# Altium schematic sheet MCU-main-board-schematic.SchDoc: MCU-main-board Swiss Solar Boat
size A4; Date: 04.03.2022; SheetNumber: 1; SheetTotal: 2
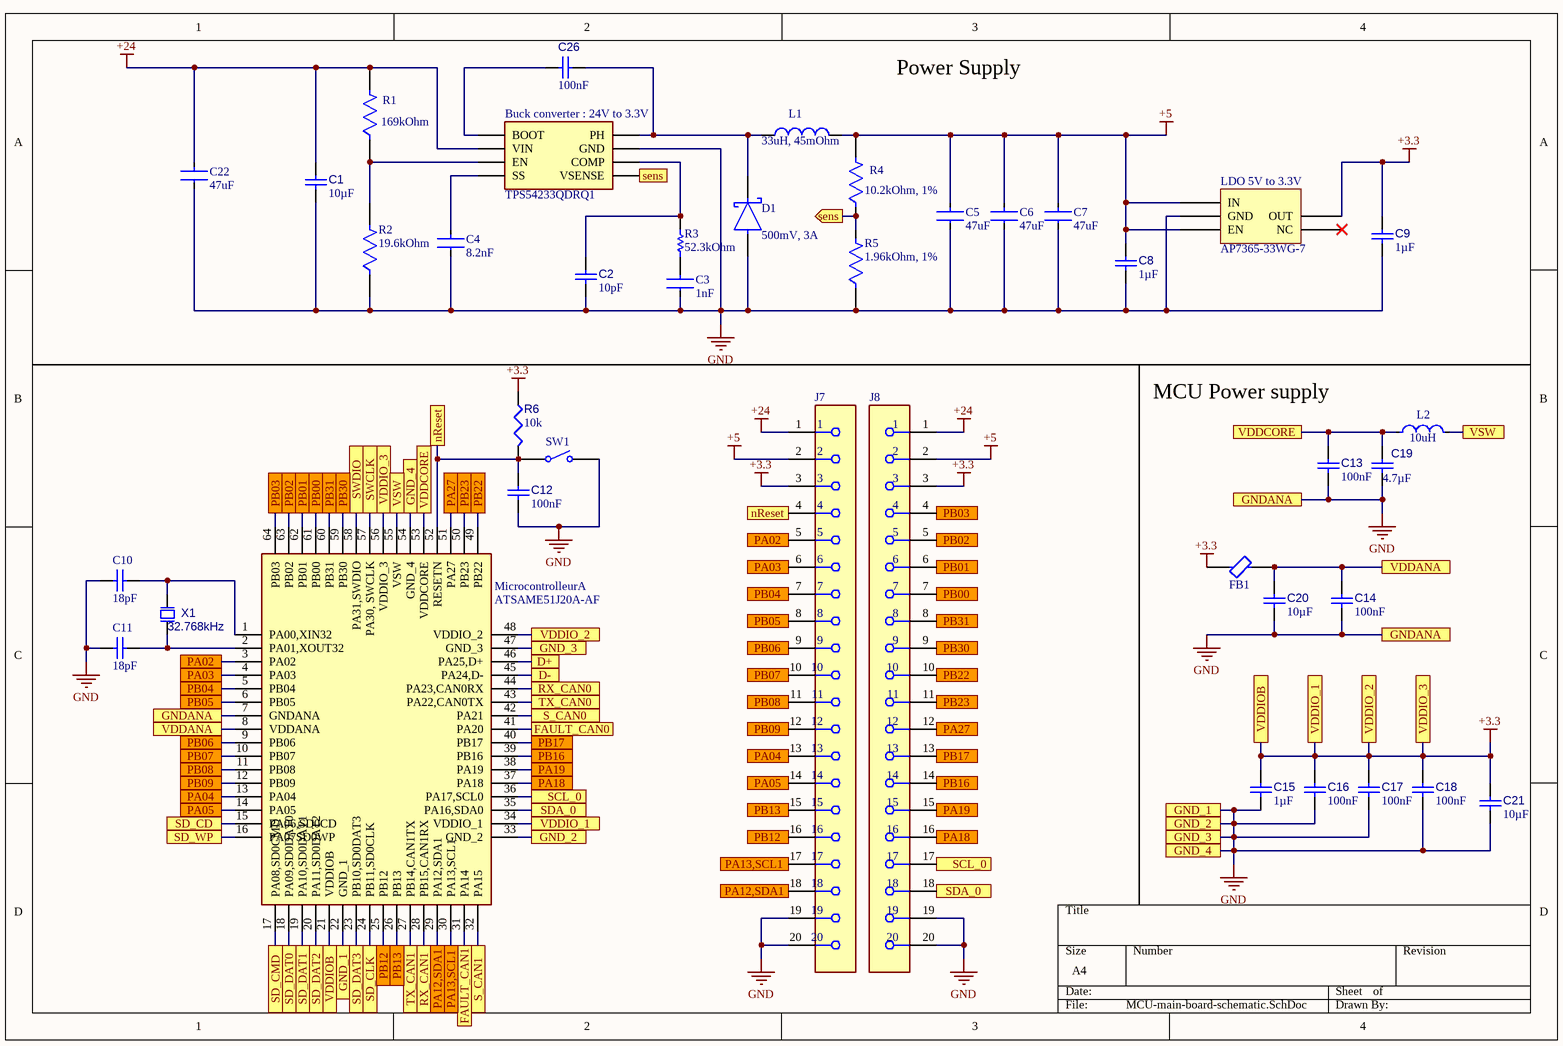
[diagram p0: MCU-main-board-schematic.SchDoc]

## Parts
Buck_converter_:_24V_to_3.3V  TPS54233QDRQ1  [SOIC127P600X175-8N]
C1  value 10µF  [CAPC0805(2012)145_L]  (hidden comment: Capacitor 10µF +/-20% 25V 0805)
C2  value 10pF  [CAPC1608X90X40ML10T20]  (hidden comment: Capacitor 10 pF +/- 5% 50 V 0603)
C3  1nF  [FP-0603-L_1_6_0_15-W_0_81-IPC_A]
C4  8.2nF  [FP-CL10-IPC_B]
C5  47uF  [FP-GRM32E-0_3-0_2-IPC_C]
C6  47uF  [FP-GRM32E-0_3-0_2-IPC_C]
C7  47uF  [FP-GRM32E-0_3-0_2-IPC_C]
C8  value 1µF  [CAPC0603(1608)100_L]  (hidden comment: Capacitor 1µF +/-40% 50V 0603)
C9  value 1µF  [CAPC0603(1608)100_L]  (hidden comment: Capacitor 1µF +/-40% 50V 0603)
C10  18pF  [CAPC1608X90X40LL10T20]
C11  18pF  [CAPC1608X90X40LL10T20]
C12  value 100nF  [CAPC1608X90X40ML10T20]  (hidden comment: Capacitor 100 nF +/-10% 50 V 0603)
C13  value 100nF  [CAPC1608X90X40ML10T20]  (hidden comment: Capacitor 100 nF +/-10% 50 V 0603)
C14  value 100nF  [CAPC1608X90X40ML10T20]  (hidden comment: Capacitor 100 nF +/-10% 50 V 0603)
C15  value 1µF  [CAPC0603(1608)100_L]  (hidden comment: Capacitor 1µF +/-40% 50V 0603)
C16  value 100nF  [CAPC1608X90X40ML10T20]  (hidden comment: Capacitor 100 nF +/-10% 50 V 0603)
C17  value 100nF  [CAPC1608X90X40ML10T20]  (hidden comment: Capacitor 100 nF +/-10% 50 V 0603)
C18  value 100nF  [CAPC1608X90X40ML10T20]  (hidden comment: Capacitor 100 nF +/-10% 50 V 0603)
C19  value 4.7µF  [CAPC0805(2012)145_L]  (hidden comment: Capacitor 4.7µF +/-40% 25V 0805)
C20  value 10µF  [CAPC0805(2012)145_L]  (hidden comment: Capacitor 10µF +/-20% 25V 0805)
C21  value 10µF  [CAPC0805(2012)145_L]  (hidden comment: Capacitor 10µF +/-20% 25V 0805)
C22  47uF  [FP-GRM32E-0_3-0_2-IPC_C]
C26  value 100nF  [CAPC1608X90X40ML10T20]  (hidden comment: Capacitor 100 nF +/-10% 50 V 0603)
D1  500mV, 3A  [FP-95402-MFG]
FB1  BLM18SG221TN1D  [FP-BLM18-0_15-t0_5-IPC_A]  (value not drawn)
J7  ESQ-120-14-G-S  [FP-ESQ-120-14-G-S-MFG]  (value not drawn)
J8  ESQ-120-14-G-S  [FP-ESQ-120-14-G-S-MFG]  (value not drawn)
L1  33uH, 45mOhm  [WE-PD-XXL]
L2  10uH  [FP-CB3225-IPC_A]
LDO_5V_to_3.3V  AP7365-33WG-7  [SOT95P245X110-5N]
Microcontrolleur  ATSAME51J20A-AF  [QFP50P1200X1200X120-64N]  (part A of 6)
R1  169kOhm  [FP-CRCW0603-e3-IPC_C]
R2  19.6kOhm  [FP-RR0816-IPC_C]
R3  52.3kOhm  [RESC1608X55X30LL15T15]
R4  10.2kOhm, 1%  [FP-CRCW0603-e3-MFG]
R5  1.96kOhm, 1%  [FP-RR0816-IPC_C]
R6  value 10k  [RESC1608X55X25ML10T15]  (hidden comment: Resistor 10k +/-1% 0603 100 mW)
SW1  FSMSM  [TECO-FSMSM-2_V]  (value not drawn)
X1  32.768kHz  [EPSON-FC-135_V]

## Ports
D+, D-, FAULT_CAN0, FAULT_CAN1, GND_1, GND_2, GND_3, GND_4, GNDANA, nReset, PA02, PA03, PA04, PA05, PA12,SDA1, PA13,SCL1, PA18, PA19, PA27, PB00, PB01, PB02, PB03, PB04, PB05, PB06, PB07, PB08, PB09, PB12, PB13, PB16, PB17, PB22, PB23, PB30, PB31, RX_CAN0, RX_CAN1, S_CAN0, S_CAN1, SCL_0, SD_CD, SD_CLK, SD_CMD, SD_DAT0, SD_DAT1, SD_DAT2, SD_DAT3, SD_WP, SDA_0, sens (in), sens (out), SWCLK, SWDIO, TX_CAN0, TX_CAN1, VDDANA, VDDCORE, VDDIO_1, VDDIO_2, VDDIO_3, VDDIOB, VSW

## Nets
+3.3: C9.2 C15.2 C16.2 C17.2 C18.2 C21.2 FB1.1 J7.3 J8.3 LDO_5V_to_3.3V.5(OUT) Microcontrolleur.21(VDDIOB) Microcontrolleur.34(VDDIO_1) Microcontrolleur.48(VDDIO_2) Microcontrolleur.56(VDDIO_3) R6.1 ; port VDDIO_1, port VDDIO_2, port VDDIO_3, port VDDIOB
+5: C5.1 C6.1 C7.1 C8.2 J7.2 J8.2 L1.2 LDO_5V_to_3.3V.1(IN) LDO_5V_to_3.3V.3(EN) R4.2
+24: Buck_converter_:_24V_to_3.3V.2(VIN) C1.2 C22.1 J7.1 J8.1 R1.2
GND: Buck_converter_:_24V_to_3.3V.7(GND) C1.1 C2.1 C3.2 C4.2 C5.2 C6.2 C7.2 C8.1 C9.1 C10.1 C11.1 C12.1 C13.1 C14.1 C15.1 C16.1 C17.1 C18.1 C19.1 C20.1 C21.1 C22.2 D1.2(A) J7.19 J7.20 J8.19 J8.20 LDO_5V_to_3.3V.2(GND) Microcontrolleur.7(GNDANA) Microcontrolleur.22(GND_1) Microcontrolleur.33(GND_2) Microcontrolleur.47(GND_3) Microcontrolleur.54(GND_4) R2.1 R5.1 SW1.2 ; port GND_1, port GND_2, port GND_3, port GND_4, port GNDANA
D+: Microcontrolleur.46(PA25,D+) ; port D+
D-: Microcontrolleur.45(PA24,D-) ; port D-
FAULT_CAN0: Microcontrolleur.41(PA20) ; port FAULT_CAN0
FAULT_CAN1: Microcontrolleur.31(PA14) ; port FAULT_CAN1
nReset: C12.2 J7.4 Microcontrolleur.52(RESETN) R6.2 SW1.1 ; port nReset
PA02: J7.5 Microcontrolleur.3(PA02) ; port PA02
PA03: J7.6 Microcontrolleur.4(PA03) ; port PA03
PA04: J7.13 Microcontrolleur.13(PA04) ; port PA04
PA05: J7.14 Microcontrolleur.14(PA05) ; port PA05
PA12,SDA1: J7.18 Microcontrolleur.29(PA12,SDA1) ; port PA12,SDA1
PA13,SCL1: J7.17 Microcontrolleur.30(PA13,SCL1) ; port PA13,SCL1
PA18: J8.16 Microcontrolleur.37(PA18) ; port PA18
PA19: J8.15 Microcontrolleur.38(PA19) ; port PA19
PA27: J8.12 Microcontrolleur.51(PA27) ; port PA27
PB00: J8.7 Microcontrolleur.61(PB00) ; port PB00
PB01: J8.6 Microcontrolleur.62(PB01) ; port PB01
PB02: J8.5 Microcontrolleur.63(PB02) ; port PB02
PB03: J8.4 Microcontrolleur.64(PB03) ; port PB03
PB04: J7.7 Microcontrolleur.5(PB04) ; port PB04
PB05: J7.8 Microcontrolleur.6(PB05) ; port PB05
PB06: J7.9 Microcontrolleur.9(PB06) ; port PB06
PB07: J7.10 Microcontrolleur.10(PB07) ; port PB07
PB08: J7.11 Microcontrolleur.11(PB08) ; port PB08
PB09: J7.12 Microcontrolleur.12(PB09) ; port PB09
PB12: J7.16 Microcontrolleur.25(PB12) ; port PB12
PB13: J7.15 Microcontrolleur.26(PB13) ; port PB13
PB16: J8.14 Microcontrolleur.39(PB16) ; port PB16
PB17: J8.13 Microcontrolleur.40(PB17) ; port PB17
PB22: J8.10 Microcontrolleur.49(PB22) ; port PB22
PB23: J8.11 Microcontrolleur.50(PB23) ; port PB23
PB30: J8.9 Microcontrolleur.59(PB30) ; port PB30
PB31: J8.8 Microcontrolleur.60(PB31) ; port PB31
RX_CAN0: Microcontrolleur.44(PA23,CAN0RX) ; port RX_CAN0
RX_CAN1: Microcontrolleur.28(PB15,CAN1RX) ; port RX_CAN1
S_CAN0: Microcontrolleur.42(PA21) ; port S_CAN0
S_CAN1: Microcontrolleur.32(PA15) ; port S_CAN1
SCL_0: J8.17 Microcontrolleur.36(PA17,SCL0) ; port SCL_0
SD_CD: Microcontrolleur.15(PA06,SD0CD) ; port SD_CD
SD_CLK: Microcontrolleur.24(PB11,SD0CLK) ; port SD_CLK
SD_CMD: Microcontrolleur.17(PA08,SD0CMD) ; port SD_CMD
SD_DAT0: Microcontrolleur.18(PA09,SD0DAT0) ; port SD_DAT0
SD_DAT1: Microcontrolleur.19(PA10,SD0DAT1) ; port SD_DAT1
SD_DAT2: Microcontrolleur.20(PA11,SD0DAT2) ; port SD_DAT2
SD_DAT3: Microcontrolleur.23(PB10,SD0DAT3) ; port SD_DAT3
SD_WP: Microcontrolleur.16(PA07SD0WP) ; port SD_WP
SDA_0: J8.18 Microcontrolleur.35(PA16,SDA0) ; port SDA_0
sens: Buck_converter_:_24V_to_3.3V.5(VSENSE) R4.1 R5.2 ; port sens
SWCLK: Microcontrolleur.57(PA30,_SWCLK) ; port SWCLK
SWDIO: Microcontrolleur.58(PA31,SWDIO) ; port SWDIO
TX_CAN0: Microcontrolleur.43(PA22,CAN0TX) ; port TX_CAN0
TX_CAN1: Microcontrolleur.27(PB14,CAN1TX) ; port TX_CAN1
VDDANA: C14.2 C20.2 FB1.2 Microcontrolleur.8(VDDANA) ; port VDDANA
VDDCORE: C13.2 C19.2 L2.1 Microcontrolleur.53(VDDCORE) ; port VDDCORE
VSW: L2.2 Microcontrolleur.55(VSW) ; port VSW
NetBuck_converter_:_24V_to_3.3V_1: Buck_converter_:_24V_to_3.3V.1(BOOT) C26.2
NetBuck_converter_:_24V_to_3.3V_3: Buck_converter_:_24V_to_3.3V.3(EN) R1.1 R2.2
NetBuck_converter_:_24V_to_3.3V_4: Buck_converter_:_24V_to_3.3V.4(SS) C4.1
NetBuck_converter_:_24V_to_3.3V_6: Buck_converter_:_24V_to_3.3V.6(COMP) C2.2 R3.2
NetBuck_converter_:_24V_to_3.3V_8: Buck_converter_:_24V_to_3.3V.8(PH) C26.1 D1.1(C) L1.1
NetC3_1: C3.1 R3.1
NetC10_2: C10.2 Microcontrolleur.1(PA00,XIN32) X1.1
NetC11_2: C11.2 Microcontrolleur.2(PA01,XOUT32) X1.2

Not connected (* = marked no-connect by the designer): LDO_5V_to_3.3V 4(NC)*

## Notes on the sheet
- Power Supply
- MCU Power supply

## Library data of the parts
Buck_converter_:_24V_to_3.3V = TPS54233QDRQ1: Integrated Circuit; Manufacturer_Name: Texas Instruments; Datasheet Link: http://www.ti.com/lit/gpn/tps54233-q1; Height: 1.75mm; Manufacturer_Part_Number: TPS54233QDRQ1; Mouser Part Number: 595-TPS54233QDRQ1; Mouser Price/Stock: https://www.mouser.co.uk/ProductDetail/Texas-Instruments/TPS54233QDRQ1?qs=5771e39Rz9EgVp4sSedJGA%3D%3D; Arrow Part Number: TPS54233QDRQ1; Arrow Price/Stock: https://www.arrow.com/en/products/tps54233qdrq1/texas-instruments
C1 C20 C21 = CMP-001-00079-2: Chip Capacitor, 10µF +/-20%, 25V, 0805, Thickness 1.45 mm; Tolerance: 10%; Pins: 2; Max Operating Temperature: 85°C; Mounting Technology: SMT; Case/Package: 0603; Voltage Rating: 25V; Min Operating Temperature: -55°C
C2 = CMP-001-00014-4: Chip Capacitor, 10 pF, +/- 5%, 50 V, 0603 (1608 Metric); Voltage Rating: 50V; Capacitor Type: Ceramic; RoHS Compliant: True; Max Operating Temperature: 125°C; Pins: 2; Tolerance: 5%; Case/Package: 0603; Mounting Technology: SM; Min Operating Temperature: -55°C
C3 = CMP-2006-04378-2: General Purpose Ceramic Capacitor, 0603, 1nF, 10%, X7R, 15%, 50V; Case Code (Metric): 1608; Min Operating Temperature: -55°C; Weight: 7.1E-05oz; Series: -; Capacitance: 1nF; RoHS Compliant: Yes; Radiation Hardening: No; Height: 0.9mm; Mount: Surface Mount; REACH SVHC: No SVHC; Lead Free: Lead Free; Depth: 0.81mm; Voltage: 50V; Number of Pins: 2; Voltage Rating: 50V; Max Operating Temperature: 125°C; Termination: SMD/SMT; Construction: Flat; Case Code (Imperial): 0603; Dielectric: X7R; Width: 0.032inch; Tolerance: 10%; Case/Package: 0603; Contact Plating: Tin; Packaging: Tape and Reel; Voltage Rating (DC): 50V; Dielectric Material: Ceramic; Package Quantity: 4000; Thickness: 0.035inch; Length: 1.6mm
C4 = CMP-2000-06097-2: Cap Ceramic 8.2nF 50V X7R ±10% Pad SMD 0603 +125°C T/R; Voltage Rating: 50V; Dielectric: X7R; Length: 1.6mm; Mount: Surface Mount; Lead Free: Lead Free; Width: 0.031inch; Series: CL; Case Code (Imperial): 0603; Capacitance: 8.2nF; Case/Package: 0603; RoHS Compliant: Yes; Package Quantity: 1; Material: Ceramic; Voltage: 50V; Voltage Rating (DC): 50V; Thickness: 0.035inch; Max Operating Temperature: 125°C; Height: 0.8mm; Min Operating Temperature: -55°C; Tolerance: 10%; Depth: 0.8mm; Radiation Hardening: No; Case Code (Metric): 1608; Packaging: Tape and Reel; Construction: Flat
C5-C7 C22 = CMP-2000-06362-2: CAP CER 47UF 16V X5R 1210; Tolerance: 10%; Material: Ceramic; Case Code (Metric): 3225; RoHS Compliant: Yes; Min Operating Temperature: -55°C; Radiation Hardening: No; Voltage: 16V; Package Quantity: 1; Case Code (Imperial): 1210; REACH SVHC: No SVHC; Capacitance: 47uF; Voltage Rating (DC): 16V; Dielectric: X5R; Case/Package: 1210; Length: 3.2mm; Voltage Rating: 16V; Packaging: Cut Tape; Width: 0.098inch; Number of Pins: 2; Lead Free: Lead Free; Height: 2.5mm; Mount: Surface Mount; Termination: SMD/SMT; Max Operating Temperature: 85°C; Thickness: 0.106inch; Depth: 2.5mm
C8 C9 C15 = CMP-001-00078-2: Chip Capacitor, 1µF +/-40%, 50V, 0603, Thickness 1 mm; Tolerance: 10%; Max Operating Temperature: 85°C; Voltage Rating: 50V; Pins: 2; Case/Package: 0402; Mounting Technology: SMT; Min Operating Temperature: -55°C
C10 C11 = CMP-1659-00030-1: Chip Capacitor, 18 pF, +/- 5%, 50 V, -55 to 125 degC, 0603 (1608 Metric), RoHS, Tape and Reel; Voltage Rating: 50 V; Case\Package: 0603; Power Rating: 100 mW; Resistance: 68.1 Ohm; Tolerance: 1%; Case Code (Metric): 1608; Max Operating Temperature: 155 degC; RoHSCompliant: true; Case Code (Imperial): 0603; ComponentLink2Description: Datasheet; Package Quantity: 200; PackageReference: 0603; ComponentLink2URL: http://www.yageo.com/NewPortal/yageodocoutput?fileName=/pdf/MLCC/UPY-GP_NP0_16V-to-50V_14.pdf; Length: 1.6 mm; DatasheetVersion: Rev. 14, 07/2016; Min Operating Temperature: -55 degC; ComponentLink1URL: http://www.yageo.com/; Width: 0.8 mm; ComponentLink1Description: Manufacturer URL; Height: 0.45 mm; Radiation Hardening: No; PackageDescription: 2-Pin Surface Mount Device, Body 1.6 x 0.8 mm; Packaging: Tape and Reel
C12-C14 C16-C18 C26 = CMP-001-00017-4: Chip Capacitor, 100 nF, +/- 10%, 50 V, 0603 (1608 Metric); Capacitor Type: Ceramic; Voltage Rating: 50V; RoHS Compliant: True; Max Operating Temperature: 125°C; Pins: 2; Mounting Technology: SM; Min Operating Temperature: -55°C; Tolerance: 10%; Case/Package: 0603
C19 = CMP-001-00080-2: Chip Capacitor, 4.7µF +/-40%, 25V, 0805, Thickness 1.45 mm; Tolerance: 20%; Voltage Rating: 25V; Min Operating Temperature: -55°C; Case/Package: 0402; Pins: 2; Mounting Technology: SMT; Max Operating Temperature: 85°C
D1 = CMP-02539-000012-1: DIODE SCHOTTKY 40V 3A DO214AB; Manufacturer: Vishay; Manufacturer Part Number: SS34-E3/57T; Max Junction Temp: +150°C; Peak Reverse Current: 0.5mA; Max Surge Forward Current: 100A; Standoff Height: 0mm; ComponentLink2Description: Datasheet; Device Class L3: Schottky Diodes; Height: 2.62mm; Max Repetitive Reverse Voltage: 40V; Lead Free: Yes; Package: 95402; Temperature Range High: +150°C; ComponentLink2URL: http://www.vishay.com/docs/88751/ss32.pdf; Temperature: -55°C to +150°C; Footprint Url: http://www.vishay.com/docs/95402/smc.pdf; Automotive: No; Forward Current: 3A; Category: Diode; RoHS: TRUE; Device Class L2: Diodes; Mouser Description: Schottky Diodes & Rectifiers 3.0 Amp 40 Volt; Octopart: https://octopart.com/ss34-e3%2F57t-vishay-39552907; Temperature Range Low: -55°C; Device Class L1: Discrete Semiconductors; Digikey Description: DIODE SCHOTTKY 40V 3A DO214AB
FB1 = CMP-0686-00596-3: Chip Ferrite Bead, 0603, 220Ω @ 100MHz, 25%, 0.04Ω, 2.5A, BLM18SG221TN1D; Impedance: 220R; DC Resistance-Max: 40mR; Number of Circuits: 1; Test Frequency: 100MHz; Material: Ferrite; Lead Free: Lead Free; Width: 0.8mm; Max Current Rating: 2.5A; Termination: SMD/SMT; Depth: 0.95mm; Packaging: Tape and Reel; Case Code (Metric): 1608; DC Current: 2.5A; Weight: 7.1E-05oz; Min Operating Temperature: -55°C; DC Resistance (DCR): 40mR; Max Operating Temperature: 125°C; Core Material: Ferrite; Max DC Current: 2.5A; Case/Package: 0603; REACH SVHC: No SVHC; Height: 0.8mm; Number of Pins: 2; Tolerance: 25%; RoHS Compliant: Yes; Radiation Hardening: No; Current Rating: 2.5A; Number of Lines: 1; Series: BLM18S; Case Code (Imperial): 0603; Length: 1.6mm; Package Quantity: 1
J7 J8 = CMP-02766-000124-1: CONN SOCKET 20POS 0.1 GOLD PCB; Connector Type: Receptacle; Number of Contacts: 20; Contact Resistance: 10mR; Max Voltage Rating (AC): 550V; Max Current Rating: 6.9A; Pitch: 2.54mm; Termination: Solder; Number of Rows: 1; Contact Material: Bronze; Min Operating Temperature: -55°C; Gender: Receptacle; Length: 51.31mm; Orientation: Straight; Max Operating Temperature: 125°C; Radiation Hardening: No; Housing Color: Black; Contact Plating: Gold; REACH SVHC: No SVHC; Packaging: Rail/Tube; Depth: 2.41mm; Housing Material: Polyester; Number of Positions: 20; Mount: Through Hole; Color: Black
L1 = CMP-0227-00179-1: SMD-Shielded Power Inductor WE-PD, L = 33.0 µH; Inductance: 33.0 ÂµH; ComponentLink2Description: Datasheet; PackageVersion: 2004; DatasheetVersion: ver 1, Oct-2004; PackageDescription: SMD Inductor, 2-Leads, Body 12.0 x 12.0 mm; ComponentLink1URL: http://www.we-online.com; ComponentLink2URL: http://www.we-online.de/katalog/media/pdf/7447709330.pdf; PackageReference: WE-PD-XXL; ComponentLink1Description: Manufacturer Link
L2 = CMP-14484-000123-1: SMD Inductors 10uH ±20% 0.9A 0.1729Ω 1210; Shielding: Unshielded; DC Resistance (DCR): 172.9mR; Core Material: Ferrite; Self Resonant Frequency: 23MHz; Max DC Current: 900mA; Test Frequency: 100kHz; Package Quantity: 1000; Military Standard: Not; Inductance: 10uH; Height: 2.5mm; Case Code (Metric): 3225; Width: 0.098inch; Case Code (Imperial): 1210; Inductance Tolerance: 20%; Lead Free: Lead Free; Length: 3.4mm; Max Operating Temperature: 105°C; Resistor Type: Wirewound; Height - Seated (Max): 0.106inch; Series: CB; Packaging: Tape and Reel; Depth: 2.7mm; Number of Pins: 2; Radiation Hardening: No; Tolerance: 20%; Case/Package: 1210; Mount: Surface Mount; Saturation Current: 900mA; Min Operating Temperature: -40°C; DC Current: 900mA; Current Rating: 900mA; Halogen Free: Halogen Free; Termination: SMD/SMT
LDO_5V_to_3.3V = CMP-019-00049-1: IC REG LDO 3.3V 0.6A SOT-25
Microcontrolleur = CMP-002-000002-1: Integrated Circuit; Manufacturer_Name: Microchip; Source: SamacSys.SchLib; Design Item ID: ATSAME51J20A-AF; Manufacturer_Part_Number: ATSAME51J20A-AF; Mouser Price/Stock: https://www.mouser.co.uk/ProductDetail/Microchip-Technology-Atmel/ATSAME51J20A-AF?qs=y6ZabgHbY%252ByKmI%252BFD2VVtQ%3D%3D; Datasheet Link: http://www.microchip.com/mymicrochip/filehandler.aspx?ddocname=en599585; Mouser Part Number: 556-ATSAME51J20A-AF; Height: 1.2mm
R1 = CMP-1012-00760-2: RES Thick Film, 169kΩ, 1%, 0.1W, 100ppm/°C, 0603; Resistance: 169kR; Voltage Rating: 75V; Max Power Dissipation: 100mW; Case Code (Metric): 1608; Radiation Hardening: No; Weight: 7.1E-05oz; Number of Terminations: 2; Contact Plating: Tin; Package Quantity: 10; Military Standard: Not; Composition: Thick Film; Features: Automotive AEC-Q200; Packaging: Tape and Reel; Depth: 0.85mm; Lead Free: Lead Free; Max Operating Temperature: 155°C; Height: 0.45mm; Length: 1.55mm; Temperature Coefficient: 100ppm/°C; Tolerance: 1%; Power Rating: 100mW; Termination: SMD/SMT; Width: 0.033inch; Case/Package: 0603; Min Operating Temperature: -55°C; Case Code (Imperial): 0603; Working Voltage: 75V; Number of Pins: 2; Voltage Rating (DC): 75V
R2 = CMP-2000-02522-2: 19.6kΩ ±0.5% 0.0625W 1/16W Chip Resistor 0603 (1608 Metric) Thin Film; Max Power Dissipation: 63mW; Resistance: 19.6kR; Voltage Rating: 75V; Temperature Coefficient: 25ppm/°C; Power Rating: 62.5mW; Termination: SMD/SMT; Size Code: 0603; Length: 0.063inch; Series: RR; Package Quantity: 1; Height: 0.02inch; RoHS Compliant: Yes; Number of Terminations: 2; Lead Free: Lead Free; Packaging: Tape and Reel; Min Operating Temperature: -55°C; Tolerance: 0.5%; Case Code (Metric): 1608; Voltage Rating (DC): 75V; Case/Package: 0603; Width: 0.031inch; Resistor Type: Thin Film; Case Code (Imperial): 0603; Max Operating Temperature: 125°C
R3 = CMP-2000-00551-1: Part Number: ERJ-3EKF5232V; Manufacturer: Panasonic
R4 = CMP-2000-03840-2: RES Thick Film, 10.2kΩ, 1%, 0.1W, 100ppm/°C, 0603; Voltage Rating: 75V; Power Rating: 100mW; Resistance: 10.2kR; Packaging: Tape and Reel; Features: Automotive AEC-Q200; Case Code (Metric): 1608; Case/Package: 0603; Termination: SMD/SMT; Composition: Thick Film; Height: 0.45mm; Width: 0.033inch; Package Quantity: 10; Number of Terminations: 2; Max Operating Temperature: 155°C; Radiation Hardening: No; Case Code (Imperial): 0603; Tolerance: 1%; Weight: 7.1E-05oz; Lead Free: Lead Free; Voltage Rating (DC): 75V; Contact Plating: Tin; Depth: 0.85mm; Min Operating Temperature: -55°C; Temperature Coefficient: 100ppm/°C; Length: 1.55mm; Max Power Dissipation: 100mW; Military Standard: Not
R5 = CMP-2000-02521-2: 1.96kΩ ±0.5% 0.0625W 1/16W Chip Resistor 0603 (1608 Metric) Thin Film; Power Rating: 62.5mW; Temperature Coefficient: 25ppm/°C; Voltage Rating: 75V; Resistance: 1.96kR; Max Power Dissipation: 63mW; Width: 0.031inch; RoHS Compliant: Yes; Case/Package: 0603; Case Code (Metric): 1608; Length: 0.063inch; Termination: SMD/SMT; Series: RR; Max Operating Temperature: 125°C; Height: 0.02inch; Tolerance: 0.5%; Resistor Type: Thin Film; Min Operating Temperature: -55°C; Case Code (Imperial): 0603; Packaging: Tape and Reel; Package Quantity: 5000; Number of Terminations: 2; Voltage Rating (DC): 75V; Size Code: 0603; Lead Free: Lead Free
R6 = CMP-009-00017-4: Chip Resistor, 10 KOhm, +/- 1%, 01 W, -55 to 155 degC, 0603 (1608 Metric); Voltage Rating: 50V; Power: 100mW; Min Operating Temperature: -55°C; Tolerance: 1%; Case/Package: 0603; Pins: 2; Max Operating Temperature: 155°C; RoHS Compliant: True; Mounting Technology: SM
SW1 = CMP-2000-07511-1: FSMSM Push Button Switch, 50 mA, -35 to 85 degC, 2-Pin SMD, RoHS, Bulk; Manufacturer: TE Connectivity; Actuator Length: 1.07mm; Electrical Life: 20000Cycles; Actuator Material: Polyamide; Current Rating: 50mA; Illumination Type: Illuminated; Voltage Rating (DC): 24V; Contact Resistance: 100mOhm; Case\/Package: SMD/SMT; Operating Force: 180gf; Switch Travel: 0.25mm; Max Voltage Rating (DC): 12V; Throw Configuration: SPST; Packaging: LoosePiece; Max Operating Temperature: 85degC; ELV: Compliant; Package Description: 2-Pin Surface Mount Device, Body 6 x 3.5 mm, Pitch 9.19 mm; RoHSCompliant: true; Manufacturer URL: http://www.te.com/; Contact Plating: Silver; Contact Material: Brass; Mounting Technology: SurfaceMount; Contact Current Rating: 50mA; Datasheet Version: Rev. C2, 08/2014; Datasheet URL: http://www.te.com/commerce/DocumentDelivery/DDEController?Action=showdoc&DocId=Customer+Drawing%7F1437566-3%7FC2%7Fpdf%7FEnglish%7FENG_CD_1437566-3_C2_1437566_3_1_c.dwg.pdf%7F1437566-3; Mechanical Life: 20000Cycles; Package Reference: FSMSM; REACH SVHC: Unknown; Orientation: Straight; Min Operating Temperature: -35degC; Lead Free: LeadFree; Termination: GullWing; Package Quantity: 1000; Mount: SurfaceMount
X1 = CMP-003-00029-1: Crystal 32.768kHz 10ppm 7pF -40C +85CABS07-166-32.768KHZ-T; Pins: 2; Frequency: 32.768kHz